# Altium schematic sheet STM32.SchDoc
size A4; SheetNumber: 1; SheetTotal: 2
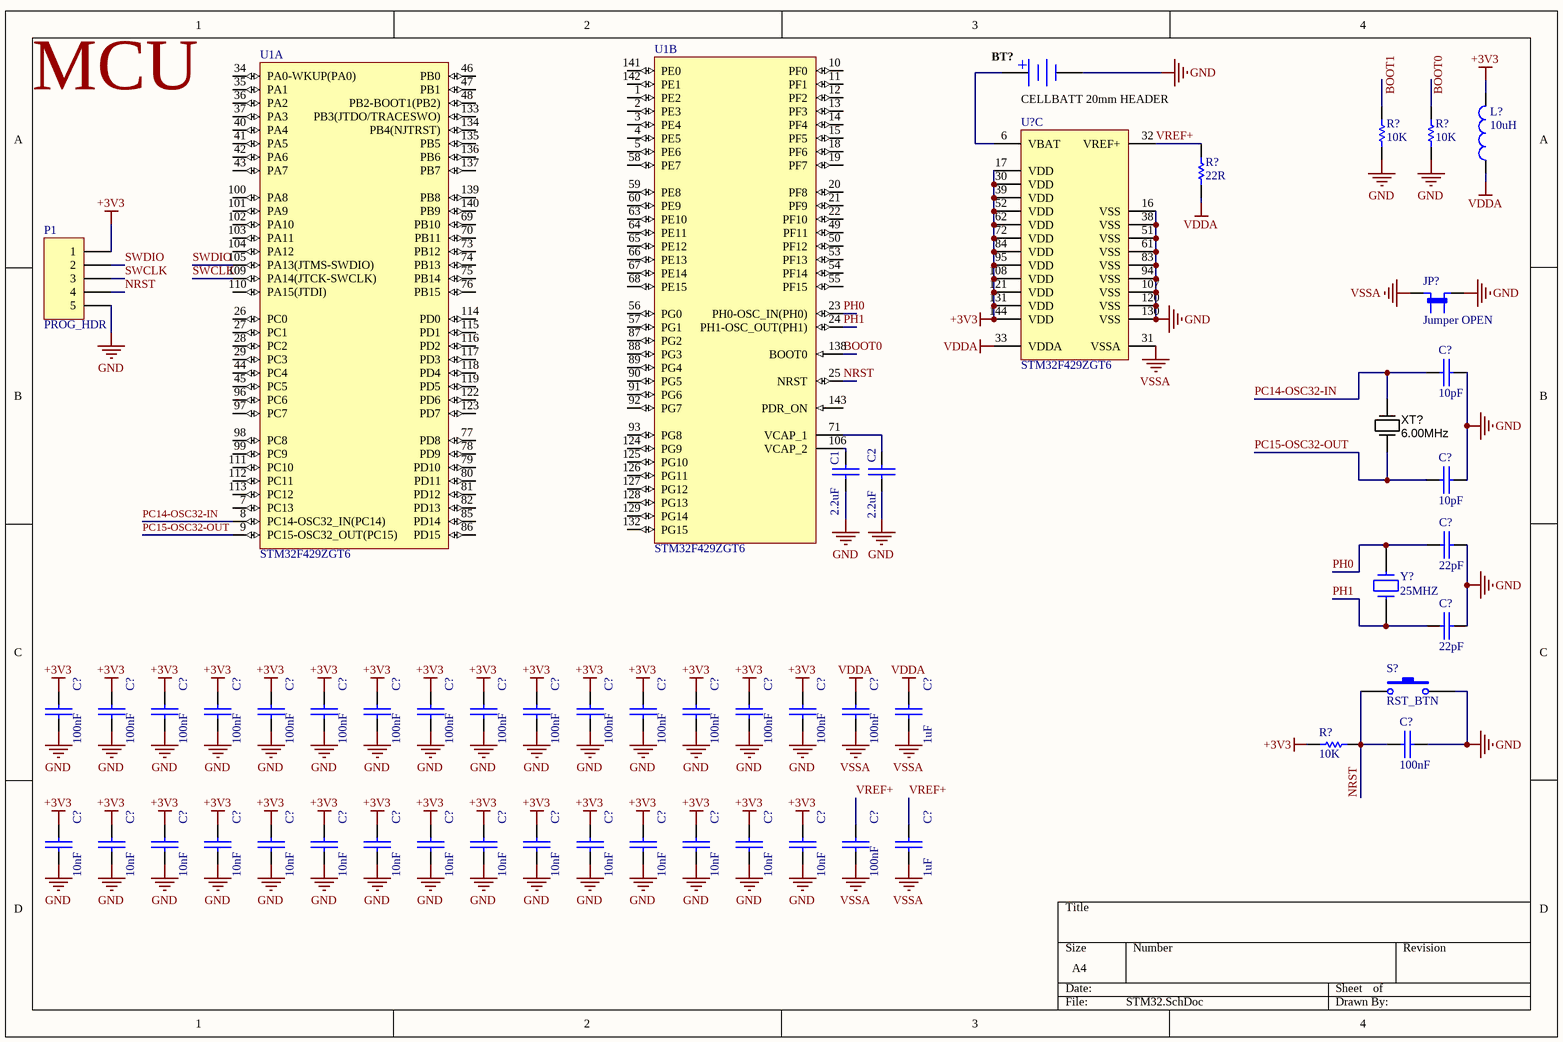
[diagram p0: STM32.SchDoc]

## Parts
(Parts that share a designator on the sheet are numbered #1, #2 ... from top to bottom, then left to right.)
BT?  CELLBATT 20mm HEADER  [SMD_CELL_HOLDER]
C1  2.2uF  [Cap-0603]
C2  2.2uF  [Cap-0603]
C?#1  10pF  [Cap-0603]
C?#2  10pF  [Cap-0603]
C?#3  22pF  [Cap-0603]
C?#4  22pF  [Cap-0603]
C?#5  100nF  [Cap-0603]
C?#6  100nF  [Cap-0603]
C?#7  100nF  [Cap-0603]
C?#8  100nF  [Cap-0603]
C?#9  100nF  [Cap-0603]
C?#10  100nF  [Cap-0603]
C?#11  100nF  [Cap-0603]
C?#12  100nF  [Cap-0603]
C?#13  100nF  [Cap-0603]
C?#14  100nF  [Cap-0603]
C?#15  100nF  [Cap-0603]
C?#16  100nF  [Cap-0603]
C?#17  100nF  [Cap-0603]
C?#18  100nF  [Cap-0603]
C?#19  100nF  [Cap-0603]
C?#20  100nF  [Cap-0603]
C?#21  1uF  [Cap-0603]
C?#22  100nF  [Cap-0603]
C?#23  10nF  [Cap-0603]
C?#24  10nF  [Cap-0603]
C?#25  10nF  [Cap-0603]
C?#26  10nF  [Cap-0603]
C?#27  10nF  [Cap-0603]
C?#28  10nF  [Cap-0603]
C?#29  10nF  [Cap-0603]
C?#30  10nF  [Cap-0603]
C?#31  10nF  [Cap-0603]
C?#32  10nF  [Cap-0603]
C?#33  10nF  [Cap-0603]
C?#34  10nF  [Cap-0603]
C?#35  10nF  [Cap-0603]
C?#36  10nF  [Cap-0603]
C?#37  10nF  [Cap-0603]
C?#38  100nF  [Cap-0603]
C?#39  1uF  [Cap-0603]
JP?  Jumper OPEN  [JP254_V]
L?  10uH  [SMD0603]
P1  PROG_HDR  [HDR1X5]
R?#1  10K  [Resistor_SMD_0603]
R?#2  10K  [Resistor_SMD_0603]
R?#3  22R  [Resistor_SMD_0603]
R?#4  10K  [Resistor_SMD_0603]
S?  RST_BTN  [SW-PB]
U1  STM32F429ZGT6  [STM-LQFP144_N]  (parts A,B of 3)
U?  STM32F429ZGT6  [STM-LQFP144_N]  (part C of 3)
XT?  6.00MHz  [CRYSTAL_CMR309T]
Y?  25MHZ  [Crystal SMD]

## Nets
+3V3: C?#5.1 C?#6.1 C?#7.1 C?#8.1 C?#9.1 C?#10.1 C?#11.1 C?#12.1 C?#13.1 C?#14.1 C?#15.1 C?#16.1 C?#17.1 C?#18.1 C?#19.1 C?#23.1 C?#24.1 C?#25.1 C?#26.1 C?#27.1 C?#28.1 C?#29.1 C?#30.1 C?#31.1 C?#32.1 C?#33.1 C?#34.1 C?#35.1 C?#36.1 C?#37.1 L?.2 P1.1 R?#4.2 U?.17(VDD) U?.30(VDD) U?.39(VDD) U?.52(VDD) U?.62(VDD) U?.72(VDD) U?.84(VDD) U?.95(VDD) U?.108(VDD) U?.121(VDD) U?.131(VDD) U?.144(VDD)
GND: BT?.2(-) C1.2 C2.2 C?#1.1 C?#2.1 C?#3.1 C?#4.1 C?#5.2 C?#6.2 C?#7.2 C?#8.2 C?#9.2 C?#10.2 C?#11.2 C?#12.2 C?#13.2 C?#14.2 C?#15.2 C?#16.2 C?#17.2 C?#18.2 C?#19.2 C?#22.2 C?#23.2 C?#24.2 C?#25.2 C?#26.2 C?#27.2 C?#28.2 C?#29.2 C?#30.2 C?#31.2 C?#32.2 C?#33.2 C?#34.2 C?#35.2 C?#36.2 C?#37.2 JP?.1 P1.5 R?#1.1 R?#2.1 S?.2 U?.16(VSS) U?.38(VSS) U?.51(VSS) U?.61(VSS) U?.83(VSS) U?.94(VSS) U?.107(VSS) U?.120(VSS) U?.130(VSS)
VDDA: C?#20.1 C?#21.1 L?.1 R?#3.2 U?.33(VDDA)
VSSA: C?#20.2 C?#21.2 C?#38.2 C?#39.2 JP?.2 U?.31(VSSA)
BOOT0: U1.138(BOOT0)
NRST: C?#22.1 P1.4 R?#4.1 S?.1 U1.25(NRST)
PC14-OSC32-IN: C?#1.2 U1.8(PC14-OSC32_IN(PC14)) XT?.2(OUT)
PC15-OSC32-OUT: C?#2.2 U1.9(PC15-OSC32_OUT(PC15)) XT?.1(IN)
PH0: C?#3.2 U1.23(PH0-OSC_IN(PH0)) Y?.2
PH1: C?#4.2 U1.24(PH1-OSC_OUT(PH1)) Y?.1
SWCLK: P1.3 U1.109(PA14(JTCK-SWCLK))
SWDIO: P1.2 U1.105(PA13(JTMS-SWDIO))
VREF+: C?#38.1 C?#39.1 R?#3.1 U?.32(VREF+)
NetBT?_1: BT?.1(+) U?.6(VBAT)
NetC1_1: C1.1 U1.106(VCAP_2)
NetC2_1: C2.1 U1.71(VCAP_1)

Not connected (* = marked no-connect by the designer): R?#1 2; R?#2 2; U1 1(PE2) 2(PE3) 3(PE4) 4(PE5) 5(PE6) 7(PC13) 10(PF0) 11(PF1) 12(PF2) 13(PF3) 14(PF4) 15(PF5) 18(PF6) 19(PF7) 20(PF8) 21(PF9) 22(PF10) 26(PC0) 27(PC1) 28(PC2) 29(PC3) 34(PA0-WKUP(PA0)) 35(PA1) 36(PA2) 37(PA3) 40(PA4) 41(PA5) 42(PA6) 43(PA7) 44(PC4) 45(PC5) 46(PB0) 47(PB1) 48(PB2-BOOT1(PB2)) 49(PF11) 50(PF12) 53(PF13) 54(PF14) 55(PF15) 56(PG0) 57(PG1) 58(PE7) 59(PE8) 60(PE9) 63(PE10) 64(PE11) 65(PE12) 66(PE13) 67(PE14) 68(PE15) 69(PB10) 70(PB11) 73(PB12) 74(PB13) 75(PB14) 76(PB15) 77(PD8) 78(PD9) 79(PD10) 80(PD11) 81(PD12) 82(PD13) 85(PD14) 86(PD15) 87(PG2) 88(PG3) 89(PG4) 90(PG5) 91(PG6) 92(PG7) 93(PG8) 96(PC6) 97(PC7) 98(PC8) 99(PC9) 100(PA8) 101(PA9) 102(PA10) 103(PA11) 104(PA12) 110(PA15(JTDI)) 111(PC10) 112(PC11) 113(PC12) 114(PD0) 115(PD1) 116(PD2) 117(PD3) 118(PD4) 119(PD5) 122(PD6) 123(PD7) 124(PG9) 125(PG10) 126(PG11) 127(PG12) 128(PG13) 129(PG14) 132(PG15) 133(PB3(JTDO/TRACESWO)) 134(PB4(NJTRST)) 135(PB5) 136(PB6) 137(PB7) 139(PB8) 140(PB9) 141(PE0) 142(PE1) 143(PDR_ON)

## Notes on the sheet
- MCU
- Labels drawn without touching a wire or pin: BOOT0, BOOT1

## Library data of the parts
BT? = CON_BATTERY: Lithium Battery Holder for CR2032 3V Cell; designer: Eng. Saeid Jorablo; Company: SJ Libraries; Max Current: mA; Category: Connector; Mounting Technology: Surface Mount\Through-Hole; Status: Unreleased; Pin Count: 2; Publisher: SJ UnLimited; ComponentLink1Description: Datasheet; ComponentLink2Description: Reference; Update: 7/8/2012; HelpURL: http://s3.picofile.com/file/7443264187/Coming_Soon_logo.gif
C1 C2 C?#1-C?#39 = Capacitor.: Capacitor; LatestRevisionDate: 17-Jul-2002; LatestRevisionNote: Re-released for DXP Platform.; Publisher: Altium Limited
  C1 C2: Value: 2.2uF
  C?#1 C?#2: Value: 10pF
  C?#3 C?#4: Value: 22pF
  C?#5-C?#20 C?#22 C?#38: Value: 100nF
  C?#21 C?#39: Value: 1uF
  C?#23-C?#37: Value: 10nF
JP? = JP_1X2: 1 X 02 Jumper; Company: SJ Libraries; Designer: Eng. Saeid Jorablo; Category: Jumpers; ComponentLink1Description: Datasheet; ComponentLink2Description: Reference; HelpURL: http://s3.picofile.com/file/7443264187/Coming_Soon_logo.gif; Mounting Technology: Surface Mount\Through-Hole; Pin Count: 2; Publisher: SJ Unlimited; Status: Unreleased
L? = Inductor: Code_IEC: 1005; Published: 8-Jun-2000; LatestRevisionDate: 29-May-2009; LatestRevisionNote: IPC-7351 Footprint Added.; PackageReference: 0402-A; Publisher: Altium Limited; PackageDescription: Chip Inductor; Code_JEITA: 0402; Value: 10uH
P1 = Header 5: Header, 5-Pin; LatestRevisionDate: 17-Jul-2002; LatestRevisionNote: Re-released for DXP Platform.; Publisher: Altium Limited
R?#1-R?#4 = Resistor: Resistor 0.25w; LatestRevisionDate: 17-Jul-2002; LatestRevisionNote: Re-released for DXP Platform.; Publisher: Altium Limited
  R?#1 R?#2 R?#4: Value: 10K
  R?#3: Value: 22R
S? = Switch PB: Push Button Switch
U1 U? = STM32F429ZGT6: ARM Cortex-M4 32-bit MCU+FPU, 225 DMIPS, 1024 kB Flash, 256 kB Internal RAM, 114 I/Os, 144-pin LQFP, -40 to 85 degC, Tray; Manufacturer: STMicroelectronics; D/A Converter: 2x12-bit; FLASH Size (Prog) (kB): 1024; I/Os (High Current): 114; Internal RAM Size (kB): 256; Operating Frequency(F) (Processor speed) (MHz): 180; Supply Voltage(Vcc) max (V): 3.6; Supply Voltage(Vcc) min (V): 1.8; DatasheetVersion: Rev. 2; PackageVersion: Rev. 4, 06/2013; PackageReference: LQFP144; PackageDescription: 144-Pin Low Profile Quad Flat Package, 20 x 20 mm Body, 0.5 mm Pitch; Supplier 1: Digi-Key; Supplier Part Number 1: STM32F429ZGT6-ND; Supplier 2: Newark; Supplier Part Number 2: 06X3675; Supplier 3: Mouser; Supplier Part Number 3: 511-STM32F429ZGT6; Core: ARM Cortex-M4; Packing: Tray; Mounting Technology: Surface Mount; PartNumber: STM32F429ZGT6; ComponentLink1Description: Manufacturer URL; ComponentLink1URL: http://www.st.com/web/en/home.html; ComponentLink2Description: Datasheet; ComponentLink2URL: http://www.st.com/st-web-ui/static/active/en/resource/technical/document/data_brief/DM00053488.pdf; ComponentLink3Description: Package Specification; ComponentLink3URL: http://www.st.com/st-web-ui/static/active/en/resource/technical/document/datasheet/DM00037051.pdf
XT? = Crystal_6MHz_CMR309T: Resonator Ceramic 6.00 MHz 30ppm; Manufacturer 1: Citizen Finetech Miyota; Manufacturer Part Number 1: CMR309T-6.000MABJ-UT; Frequency: 6MHz; Frequency Stability: ±50ppm; Load Capacitance: 18pF; Operating Mode: Fundamental; SCDType: spec; Package / Case: Cylindrical Can, Radial; Ratings: 6.00 MHz; Type: MHz Crystal; Frequency Tolerance: ±30ppm; Operating Temperature: -10°C ~ 60°C; Mounting Type: Surface Mount; Size / Dimension: 0.118" Dia x 0.346" L (3.00mm x 8.80mm); Height: 0.122" (3.10mm); Supplier 1: Digi-Key; Supplier Part Number 1: 300-8348-1-ND; Tolerance: ±50ppm; ComponentLink1URL: http://media.digikey.com/pdf/Data%20Sheets/Citizen%20PDFs/CMR310T%20CMR309T.pdf; ComponentLink1Description: http://media.digikey.com/pdf/Data%20Sheets/Citizen%20PDFs/CMR310T%20CMR309T.pdf; Value: 6.00MHz
Y? = CRYSTAL: BY: OMID HABIBI; UPDATE TIME: 94/3/28; PACKAGE: SMD LPC-3; VALUE: 25MHZ